# EAGLE design mic4826_proto (EAGLE 5.11)
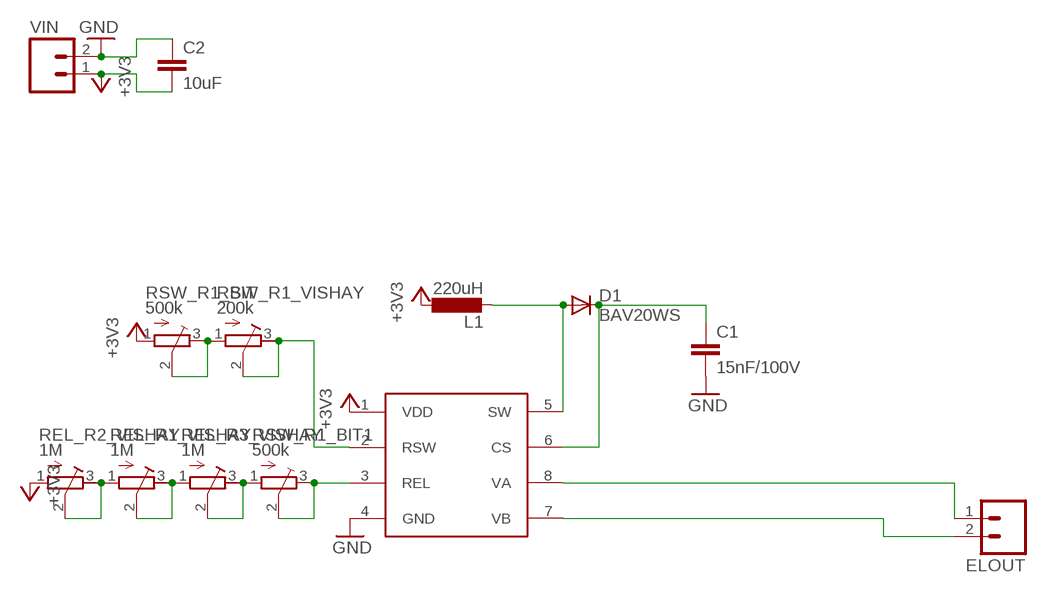
[diagram p0: schematic, sheet 1]

## Parts
C1  15nF/100V  C-EUC1210  [C1210]
C2  10uF  C-EUC0805K  [C0805K]
D1  BAV20WS  DIODESOD  [SOD-323]
ELOUT  M02PTH  [1X02]
L1  220uH  L-EUL1812  [L1812]
REL_R1_VISHAY  1M  R-TRIMMTSM53YL  [RTRIMTSM53YL]
REL_R2_VISHAY  1M  R-TRIMMTSM53YL  [RTRIMTSM53YL]
REL_R3_VISHAY  1M  R-TRIMMTSM53YL  [RTRIMTSM53YL]
RSW_R1_BIT  500k  TRIM_EU-SM-42/43W  [SM-42/43W]
RSW_R1_BIT1  500k  TRIM_EU-SM-42/43W  [SM-42/43W]
RSW_R1_VISHAY  200k  R-TRIMMTSM53YL  [RTRIMTSM53YL]
U$1  MIC4826  [MSOP8]
VIN  M02PTH  [1X02]

## Nets
+3V3: C2.2 L1.1 REL_R2_VISHAY.1(E) RSW_R1_BIT.1(A) U$1.1(VDD) VIN.1
GND: C1.2 C2.1 U$1.4(GND) VIN.2
N$1: ELOUT.2 U$1.7(VB)
N$2: ELOUT.1 U$1.8(VA)
N$3: D1.2(A) L1.2 U$1.5(SW)
N$4: C1.1 D1.1(C) U$1.6(CS)
N$5: RSW_R1_BIT.2(S) RSW_R1_BIT.3(E) RSW_R1_VISHAY.1(E)
N$6: RSW_R1_VISHAY.2(S) RSW_R1_VISHAY.3(A) U$1.2(RSW)
N$7: REL_R1_VISHAY.2(S) REL_R1_VISHAY.3(A) REL_R3_VISHAY.1(E)
N$8: RSW_R1_BIT1.2(S) RSW_R1_BIT1.3(E) U$1.3(REL)
N$9: REL_R3_VISHAY.2(S) REL_R3_VISHAY.3(A) RSW_R1_BIT1.1(A)
REL_R2_VISHAY: REL_R1_VISHAY.1(E) REL_R2_VISHAY.2(S) REL_R2_VISHAY.3(A)

## Library data of the parts
C1 C2 = rcl:C-EU: CAPACITOR, European symbol
D1 = SparkFun:DIODE: Diode These are standard reverse protection diodes and small signal diodes. SMA package can handle up to about 1A. SOD-323 can handle about 200mA. What the SOD-323 package when ordering, there are some mfgs out there that are 5-pin packages.
ELOUT VIN = SparkFun:M02: Header 2 Standard 2-pin 0.1" header. Use with straight break away headers (SKU : PRT-00116), right angle break away headers (PRT-00553), swiss pins (PRT-00743), machine pins (PRT-00117), and female headers (PRT-00115). Molex polarized connector foot print use with SKU : PRT-08233 with associated crimp pins and housings.
L1 = rcl:L-EU: INDUCTOR, European symbol
REL_R1_VISHAY REL_R2_VISHAY REL_R3_VISHAY RSW_R1_VISHAY = resistor:R-TRIMM: Trimm resistor
RSW_R1_BIT RSW_R1_BIT1 = pot:TRIM_EU-: POTENTIOMETER
U$1 = mine:MIC4826

## Board
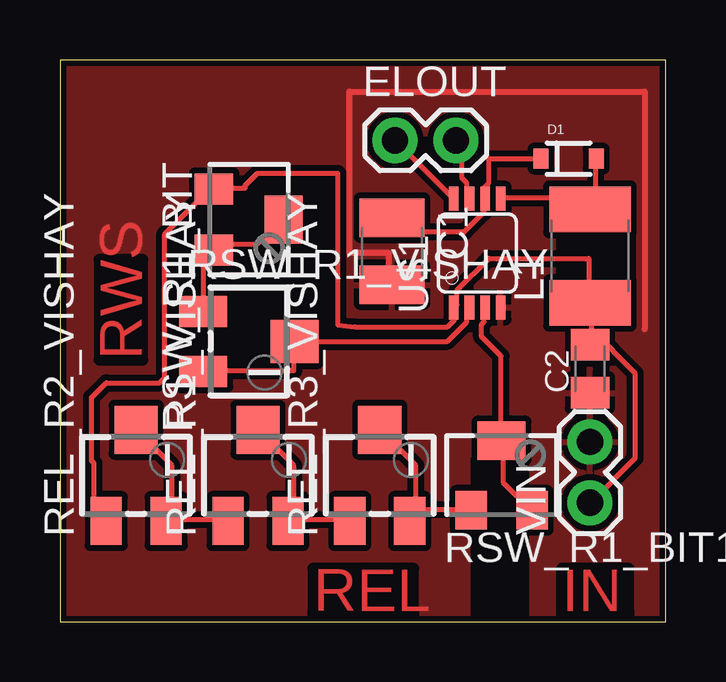
[diagram p1: board, top side]

Size 25.25 x 23.42 mm. Coordinates in mm from the lower left corner, seen from the top.
Outline: 0,0 25.25,0 25.25,23.42 0,23.42 0,0
Copper layers (1*16): Top 0.035mm / dielectric 1.5mm / Bottom 0.035mm
Design rules "ITead_rule *": minimum track width 8mil, minimum drill 12mil, track to track 8mil, track to pad 8mil, pad to pad 8mil, via to via 8mil, smd to smd 0mil, copper to edge 10mil, drill to drill 10mil, minimum pad ring 10mil, minimum via ring 6mil, stop-mask expansion 2mil, vias tented up to drill 100mil, thermal gap 10mil

### Footprints (pad centres in the part's own frame; a part is rotated, then mirrored left to right if it is on the bottom)
C1210 = smd 1.6 x 2.7: 1 -1.4,0; 2 1.4,0
C0805K = smd 1.3 x 1.6: 1 -1,0; 2 1,0
SOD-323 = smd 0.63 x 0.83: 1 -1.15,0; 2 1.15,0
1X02 = drill 1.1 pad 1.88 round: 1 0,0; 2 2.54,0
L1812 = smd 1.9 x 3.4: 1 -1.95,0; 2 1.95,0
RTRIMTSM53YL = smd 1.3 x 2: 1 -1.25,-1.9; 3 1.25,-1.9 | smd 1.8 x 2: 2 0,1.9
SM-42/43W = smd 1.3 x 1.6: 1 -1.27,-1.45; 3 1.27,-1.45 | smd 2 x 1.6: 2 0,1.45
MSOP8 = smd 0.4 x 1: 1 1.564,0.277; 2 2.214,0.277; 3 2.864,0.277; 4 3.514,0.277; 5 3.514,4.802; 6 2.864,4.802; 7 2.214,4.802; 8 1.564,4.802

### Placement (x,y rotation side)
C1  13.84,15.44 270 top
C2  22.1,10.54 90 top
D1  21.21,19.3 0 top
ELOUT  13.97,20.07 0 top
L1  22.1,15.24 90 top
REL_R1_VISHAY  8.26,6.1 0 top
REL_R2_VISHAY  3.17,6.1 0 top
REL_R3_VISHAY  13.34,6.1 0 top
RSW_R1_BIT  7.87,16.76 270 top
RSW_R1_BIT1  18.41,6.1 0 top
RSW_R1_VISHAY  7.87,11.68 270 top
U$1  14.86,12.83 0 top
VIN  22.1,4.95 90 top

### Tracks (layer width: path | path; a pad name or v marks a point on that pad's centre or on a via)
+3V3
  Top 0.203: 22.15,12.19 22.15,13.21 L1.1 22.05,13.31 22.05,15.14 17.88,15.14 16.56,13.82 16.56,13.21 16.46,13.11 U$1.1 16.46,13.01 16.46,12.6 16.15,12.29 12.29,12.29 11.58,12.37 11.58,18.69 8.23,18.69 7.72,18.19 7.72,18.09 6.5,18.09 RSW_R1_BIT.1 6.4,17.98 6.2,17.98 4.37,16.15 4.37,10.16 4.17,9.96 1.93,9.96 1.32,9.35 1.32,6.71 1.42,6.6 1.42,4.67 1.83,4.27 REL_R2_VISHAY.1 | 22.15,12.19 22.15,11.58 C2.2 | 22.15,12.19 23.98,10.36 23.98,6.81 22.15,4.98 VIN.1
GND
  Top 0.254: C1.2 13.72,14.04 13.72,15.37 12.06,15.37 12.06,22.1 24.38,22.1 24.38,12.19
  pour Top (isolate 0.254): 0,23.37 0,0 17.02,0 17.02,6.99 19.43,6.99 19.68,6.99 19.68,-0.13 25.15,-0.13 25.15,13.46 20.57,13.46 20.57,16.76 25.15,16.76 25.15,23.24
  pour Top (isolate 0.254): 23.24,11.05 25.27,11.05 25.27,19.43 22.86,19.43 22.86,18.03 24.13,18.03 24.13,11.94 23.24,11.94
N$1
  Top 0.203: U$1.7 17.07,17.68 16.97,17.78 16.97,18.29 16.76,18.49 16.76,19.81 ELOUT.2
N$2
  Top 0.203: U$1.8 16.36,17.68 ELOUT.1
N$3
  Top 0.203: 22.35,17.68 22.35,17.48 22.15,17.27 L1.2 22.35,17.68 | 22.35,17.68 D1.2 | 22.35,17.68 18.39,17.68 U$1.5
N$4
  Top 0.203: D1.1 17.88,19.3 17.88,18.29 17.68,18.09 17.68,17.68 U$1.6 17.68,17.58 17.68,17.07 16.87,16.26 13.92,16.26 13.92,16.76 C1.1
N$5
  Top 0.203: RSW_R1_VISHAY.1 5.99,13.01 5.99,15.04 6.4,15.44 RSW_R1_BIT.3 6.5,15.54 6.5,15.75 8.23,15.75 9.25,16.76 RSW_R1_BIT.2
N$6
  Top 0.203: U$1.2 17.07,13.01 16.97,12.9 16.97,12.5 16.15,11.68 RSW_R1_VISHAY.2 9.75,11.68 9.75,10.46 5.99,10.46 RSW_R1_VISHAY.3
N$7
  Top 0.203: 9.75,4.27 11.99,4.27 REL_R3_VISHAY.1 | 9.75,4.27 9.55,4.27 REL_R1_VISHAY.3 9.75,4.27 | 9.75,4.27 9.75,6.5 8.33,7.92 REL_R1_VISHAY.2
N$8
  Top 0.203: U$1.3 17.68,13.01 17.68,12.5 17.58,12.39 17.58,11.89 18.39,11.07 18.39,7.62 RSW_R1_BIT1.2 18.49,7.52 18.49,5.79 19.61,4.67 RSW_R1_BIT1.3
N$9
  Top 0.203: 14.83,4.67 14.63,4.67 14.63,4.27 REL_R3_VISHAY.3 14.83,4.67 | 14.83,4.67 17.07,4.67 RSW_R1_BIT1.1 | 14.83,4.67 14.83,6.5 13.41,7.92 REL_R3_VISHAY.2
REL_R2_VISHAY
  Top 0.203: 4.67,4.27 6.91,4.27 REL_R1_VISHAY.1 | 4.67,4.27 4.47,4.27 REL_R2_VISHAY.3 4.67,4.27 | 4.67,4.27 4.67,6.5 3.25,7.92 REL_R2_VISHAY.2

### Text on the board
Top: RWS | REL | IN